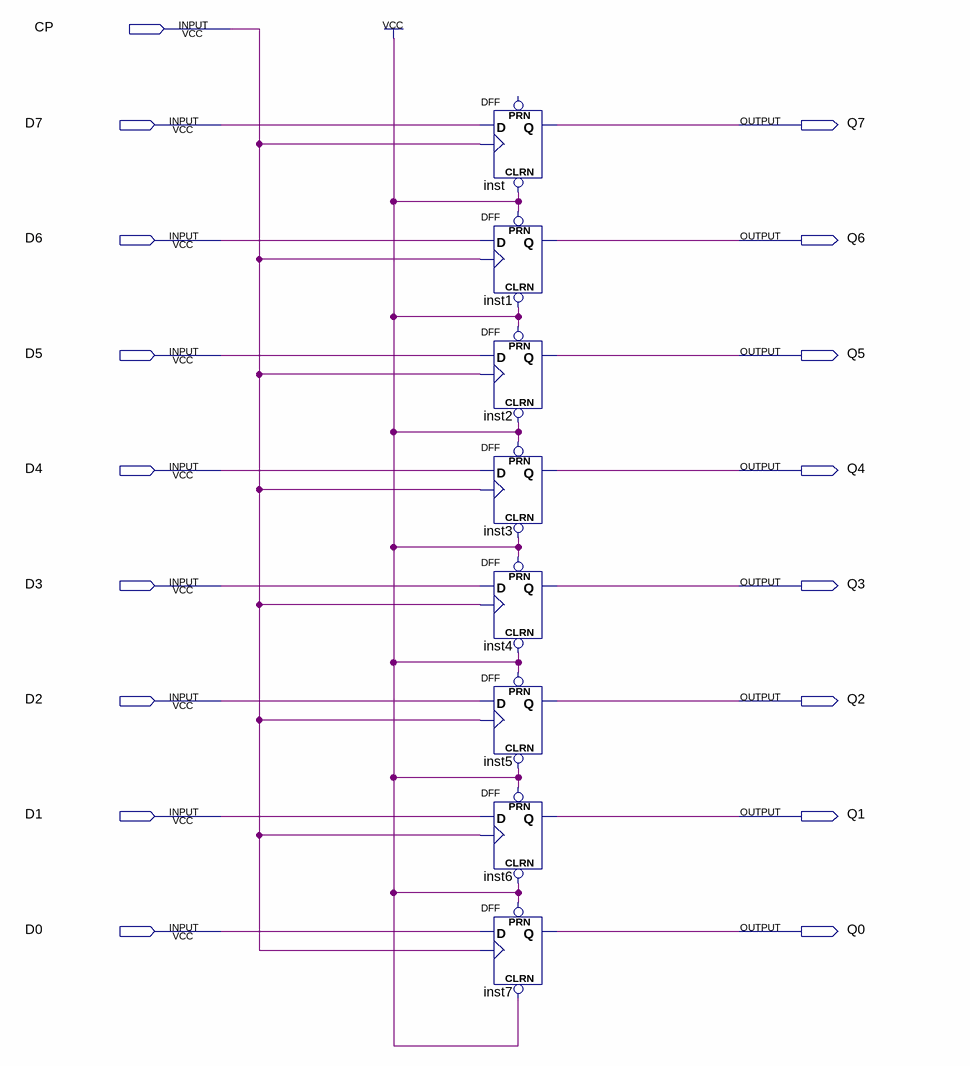
[diagram p0: schematic sheet]
// Quartus schematic R0R1.bdf as structural Verilog: 8 symbols, 17 pins
module R0R1 (
  input  CP,
  input  D7,
  input  D6,
  input  D5,
  input  D4,
  input  D3,
  input  D2,
  input  D1,
  input  D0,
  output Q7,
  output Q6,
  output Q5,
  output Q4,
  output Q3,
  output Q2,
  output Q1,
  output Q0
);

  DFF inst (.CLRN(1'b1), .CLK(CP), .D(D7), .Q(Q7));  // open: PRN
  DFF inst1 (.CLRN(1'b1), .CLK(CP), .D(D6), .PRN(1'b1), .Q(Q6));
  DFF inst2 (.CLRN(1'b1), .CLK(CP), .D(D5), .PRN(1'b1), .Q(Q5));
  DFF inst3 (.CLRN(1'b1), .CLK(CP), .D(D4), .PRN(1'b1), .Q(Q4));
  DFF inst4 (.CLRN(1'b1), .CLK(CP), .D(D3), .PRN(1'b1), .Q(Q3));
  DFF inst5 (.CLRN(1'b1), .CLK(CP), .D(D2), .PRN(1'b1), .Q(Q2));
  DFF inst6 (.CLRN(1'b1), .CLK(CP), .D(D1), .PRN(1'b1), .Q(Q1));
  DFF inst7 (.CLRN(1'b1), .CLK(CP), .D(D0), .PRN(1'b1), .Q(Q0));
endmodule
